# Altium schematic sheet Min_Sys.SchDoc
size A4
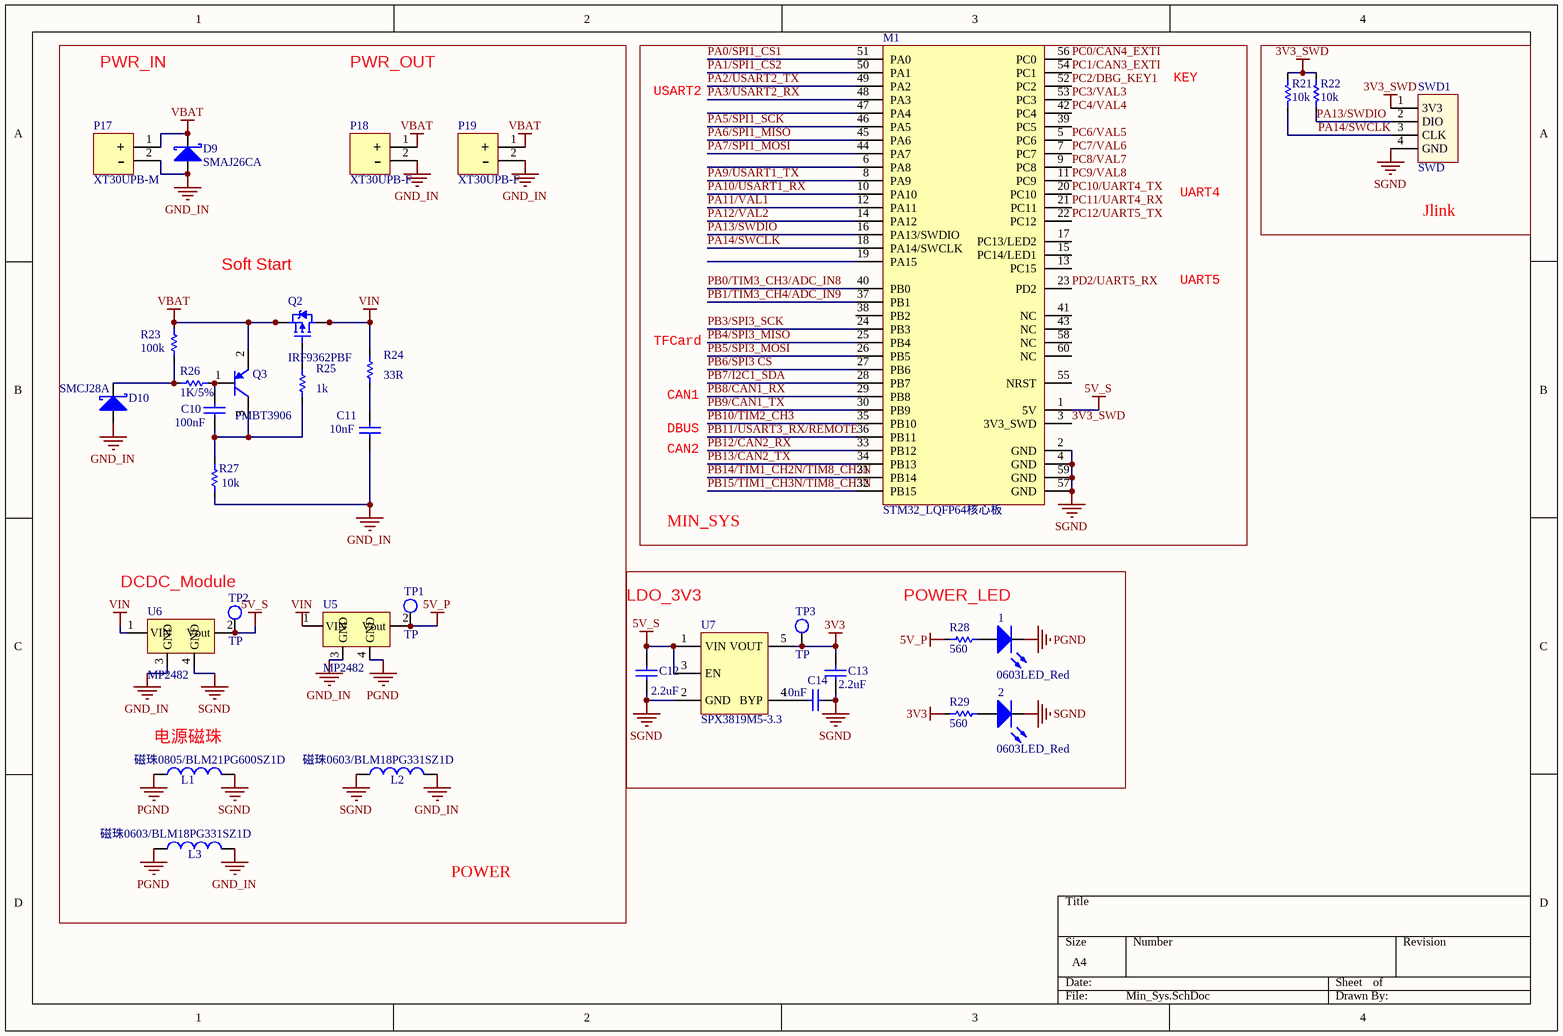
[diagram p0: Min_Sys.SchDoc]

## Parts
1  0603LED_Red  [0603LED_R]
2  0603LED_Red  [0603LED_R]
C10  100nF  [0603C]
C11  10nF  [0603C]
C12  2.2uF  [0603C]
C13  2.2uF  [0603C]
C14  10nF  [0603C]
D9  SMAJ26CA  [SMA/DO-214AC]
D10  SMCJ28A  [SMA/DO-214AC]
L1  磁珠0805/BLM21PG600SZ1D  [0805L]
L2  磁珠0603/BLM18PG331SZ1D  [0603L]
L3  磁珠0603/BLM18PG331SZ1D  [0603L]
M1  STM32_LQFP64核心板  [STM32_LQFP64核心板]
P17  XT30UPB-M  [XT30UPB-MALE]
P18  XT30UPB-F  [XT30UPB-FEMALE]
P19  XT30UPB-F  [XT30UPB-FEMALE]
Q2  IRF9362PBF  [SON5X6]
Q3  PMBT3906  [SOT-23-3]
R21  10k  [0603R]
R22  10k  [0603R]
R23  100k  [0603R]
R24  33R  [0603R]
R25  1k  [0603R]
R26  1K/5%  [0603R]
R27  10k  [0603R]
R28  560  [0603R]
R29  560  [0603R]
SWD1  SWD  [HEADER 4x1]
TP1  TP  [TP_VIA]
TP2  TP  [TP_VIA]
TP3  TP  [TP_VIA]
U5  MP2482  [MP2482_PowerModule]
U6  MP2482  [MP2482_PowerModule]
U7  SPX3819M5-3.3  [SOT-23-5 L]

## Blocks framed on the sheet
MIN_SYS: M1
Jlink: R21 R22 SWD1

## Nets
3V3: C13.1 R29.2 TP3.1(TP) U7.5(VOUT)
3V3_SWD: M1.3(3V3_SWD) R21.2 R22.2 SWD1.1(3V3)
5V_P: R28.2 TP1.1(TP) U5.2(Vout)
5V_S: C12.2 M1.1(5V) TP2.1(TP) U6.2(Vout) U7.1(VIN) U7.3(EN)
GND_IN: C11.1 D9.1 D10.1 L2.2 L3.2 P17.2(-) P18.2(-) P19.2(-) R27.2 U5.3(GND) U6.3(GND)
PGND: 1.2 L1.1 L3.1 U5.4(GND)
SGND: 2.2 C12.1 C13.2 C14.1 L1.2 L2.1 M1.2(GND) M1.4(GND) M1.57(GND) M1.59(GND) SWD1.4(GND) U6.4(GND) U7.2(GND)
VBAT: D9.2 P17.1(+) P18.1(+) P19.1(+) Q2.1(S) Q2.2(S) Q2.3(S) Q3.2(E) R23.1
VIN: Q2.5(D) Q2.6(D) Q2.7(D) Q2.8(D) Q2.9(D) R24.1 U5.1(VIN) U6.1(VIN)
PA0/SPI1_CS1: M1.51(PA0)
PA1/SPI1_CS2: M1.50(PA1)
PA2/USART2_TX: M1.49(PA2)
PA3/USART2_RX: M1.48(PA3)
PA5/SPI1_SCK: M1.46(PA5)
PA6/SPI1_MISO: M1.45(PA6)
PA7/SPI1_MOSI: M1.44(PA7)
PA9/USART1_TX: M1.8(PA9)
PA10/USART1_RX: M1.10(PA10)
PA11/VAL1: M1.12(PA11)
PA12/VAL2: M1.14(PA12)
PA13/SWDIO: M1.16(PA13/SWDIO) R22.1 SWD1.2(DIO)
PA14/SWCLK: M1.18(PA14/SWCLK) R21.1 SWD1.3(CLK)
PB0/TIM3_CH3/ADC_IN8: M1.40(PB0)
PB1/TIM3_CH4/ADC_IN9: M1.37(PB1)
PB3/SPI3_SCK: M1.24(PB3)
PB4/SPI3_MISO: M1.25(PB4)
PB5/SPI3_MOSI: M1.26(PB5)
PB6/SPI3 CS: M1.27(PB6)
PB7/I2C1_SDA: M1.28(PB7)
PB8/CAN1_RX: M1.29(PB8)
PB9/CAN1_TX: M1.30(PB9)
PB10/TIM2_CH3: M1.35(PB10)
PB11/USART3_RX/REMOTE: M1.36(PB11)
PB12/CAN2_RX: M1.33(PB12)
PB13/CAN2_TX: M1.34(PB13)
PB14/TIM1_CH2N/TIM8_CH2N: M1.31(PB14)
PB15/TIM1_CH3N/TIM8_CH3N: M1.32(PB15)
PC0/CAN4_EXTI: M1.56(PC0)
PC1/CAN3_EXTI: M1.54(PC1)
PC2/DBG_KEY1: M1.52(PC2)
PC3/VAL3: M1.53(PC3)
PC4/VAL4: M1.42(PC4)
PC6/VAL5: M1.5(PC6)
PC7/VAL6: M1.7(PC7)
PC8/VAL7: M1.9(PC8)
PC9/VAL8: M1.11(PC9)
PC10/UART4_TX: M1.20(PC10)
PC11/UART4_RX: M1.21(PC11)
PC12/UART5_TX: M1.22(PC12)
PD2/UART5_RX: M1.23(PD2)
Net1_1: 1.1 R28.1
Net2_1: 2.1 R29.1
NetC10_1: C10.1 Q3.3(C) R25.2 R27.1
NetC10_2: C10.2 Q3.1(B) R26.2
NetC11_2: C11.2 R24.2
NetC14_2: C14.2 U7.4(BYP)
NetD10_2: D10.2 R23.2 R26.1
NetQ2_4: Q2.4(G) R25.1

Not connected (* = marked no-connect by the designer): M1 6(PA8) 13(PC15) 15(PC14/LED1) 17(PC13/LED2) 19(PA15) 38(PB2) 39(PC5) 41(NC) 43(NC) 47(PA4) 55(NRST) 58(NC) 60(NC)

## Notes on the sheet
- PWR_IN
- PWR_OUT
- USART2
- KEY
- UART4
- Soft Start
- UART5
- TFCard
- DBUS
- CAN1
- CAN2
- DCDC_Module
- LDO_3V3
- POWER_LED
- (near L1) 电源磁珠
- POWER

## Library data of the parts
1 2 = LED: Typical RED, GREEN, YELLOW, AMBER GaAs LED; Published: 8-Jun-2000; LatestRevisionDate: 17-Jul-2002; LatestRevisionNote: Re-released for DXP Platform.; PackageVersion: Feb-2002; PackageReference: 3.2X1.6X1.1; Publisher: Altium Limited; PackageDescription: SM LED; 2 Flat Leads
C10-C14 = Cap: Capacitor; Value: 100pF; Published: 8-Jun-2000; LatestRevisionDate: 17-Jul-2002; LatestRevisionNote: Re-released for DXP Platform.; PackageReference: RAD-0.3; Publisher: Altium Limited; PackageDescription: Radial Cap, Thru-Hole; 2 Leads; 0.3 in Pin Spacing
D9 D10 = D Schottky_SMAF: Schottky Diode; Published: 8-Jun-2000; LatestRevisionDate: 17-Jul-2002; LatestRevisionNote: Re-released for DXP Platform.; PackageReference: SMB; Publisher: Altium Limited; PackageDescription: DO-214-AA/SMB; 2 C-Bend Leads; Body 5.3 x 3.6 mm, inc. leads (LxW); Code_JEDEC: DO-214-AA
L1-L3 = Inductor: Code_IEC: 1005; Value: 10mH; Published: 8-Jun-2000; LatestRevisionDate: 29-May-2009; LatestRevisionNote: IPC-7351 Footprint Added.; PackageReference: 0402-A; Publisher: Altium Limited; PackageDescription: Chip Inductor; Code_JEITA: 0402
M1 = STM32_LQFP64核心板: STM32_LQFP64核心板 / 兼容F105Rx、F405RGT6、F446Rx / 尺寸23mm x 25mm
P17-P19 = XT30/60/90
Q2 = PMOS: P-Channel Power MOSFET; Note: Pin 4 not drawn and electrically connected to Pin 2.; Published: 8-Jun-2000; LatestRevisionDate: 17-Jul-2002; LatestRevisionNote: Re-released for DXP Platform.; DatasheetVersion: PD-9.390D; PackageVersion: Feb-1997; PackageReference: TO-220AB; Publisher: Altium Limited; PackageDescription: TO, Thru-Hole, Vertical, Heatsink Mounted; 3 In-Line Leads; Pitch 2.54 mm; ComponentLink1Description: Manufacturer Link; ComponentLink1URL: http://www.irf.com/
Q3 = PNP: PNP Bipolar Transistor; Published: 8-Jun-2000; LatestRevisionDate: 17-Jul-2002; LatestRevisionNote: Re-released for DXP Platform.; PackageReference: TO-226-AA; Publisher: Altium Limited; PackageDescription: TO, Flat Index; 3 In-Line, Axial Leads; Body Dia. 4.8mm; Leads 0.55 x 0.51 mm (max); Code_JEDEC: TO-226-AA
R21-R24 R26-R29 = Res1: Resistor; Value: 1K; Published: 8-Jun-2000; LatestRevisionDate: 17-Jul-2002; LatestRevisionNote: Re-released for DXP Platform.; PackageReference: AXIAL-0.3; Publisher: Altium Limited; PackageDescription: Axial Device, Thru-Hole; 2 Leads; 0.3 in Pin Spacing
R25 = Res1: Resistor; Published: 8-Jun-2000; LatestRevisionDate: 17-Jul-2002; LatestRevisionNote: Re-released for DXP Platform.; PackageReference: AXIAL-0.3; Publisher: Altium Limited; PackageDescription: Axial Device, Thru-Hole; 2 Leads; 0.3 in Pin Spacing; Value: 1K
SWD1 = SWD_HEADER
TP1-TP3 = TP: Test Point
U5 U6 = MP2482_PowerModule
U7 = LDO_SOT23-5